# Altium schematic sheet reTerm-HW-M-IOLINK-STM32F4xx.SchDoc: reTerm IOLINK MCU
size 381 x 215 mm; DocumentNumber: 2; Revision: 1.0.0; SheetNumber: 3; SheetTotal: 4
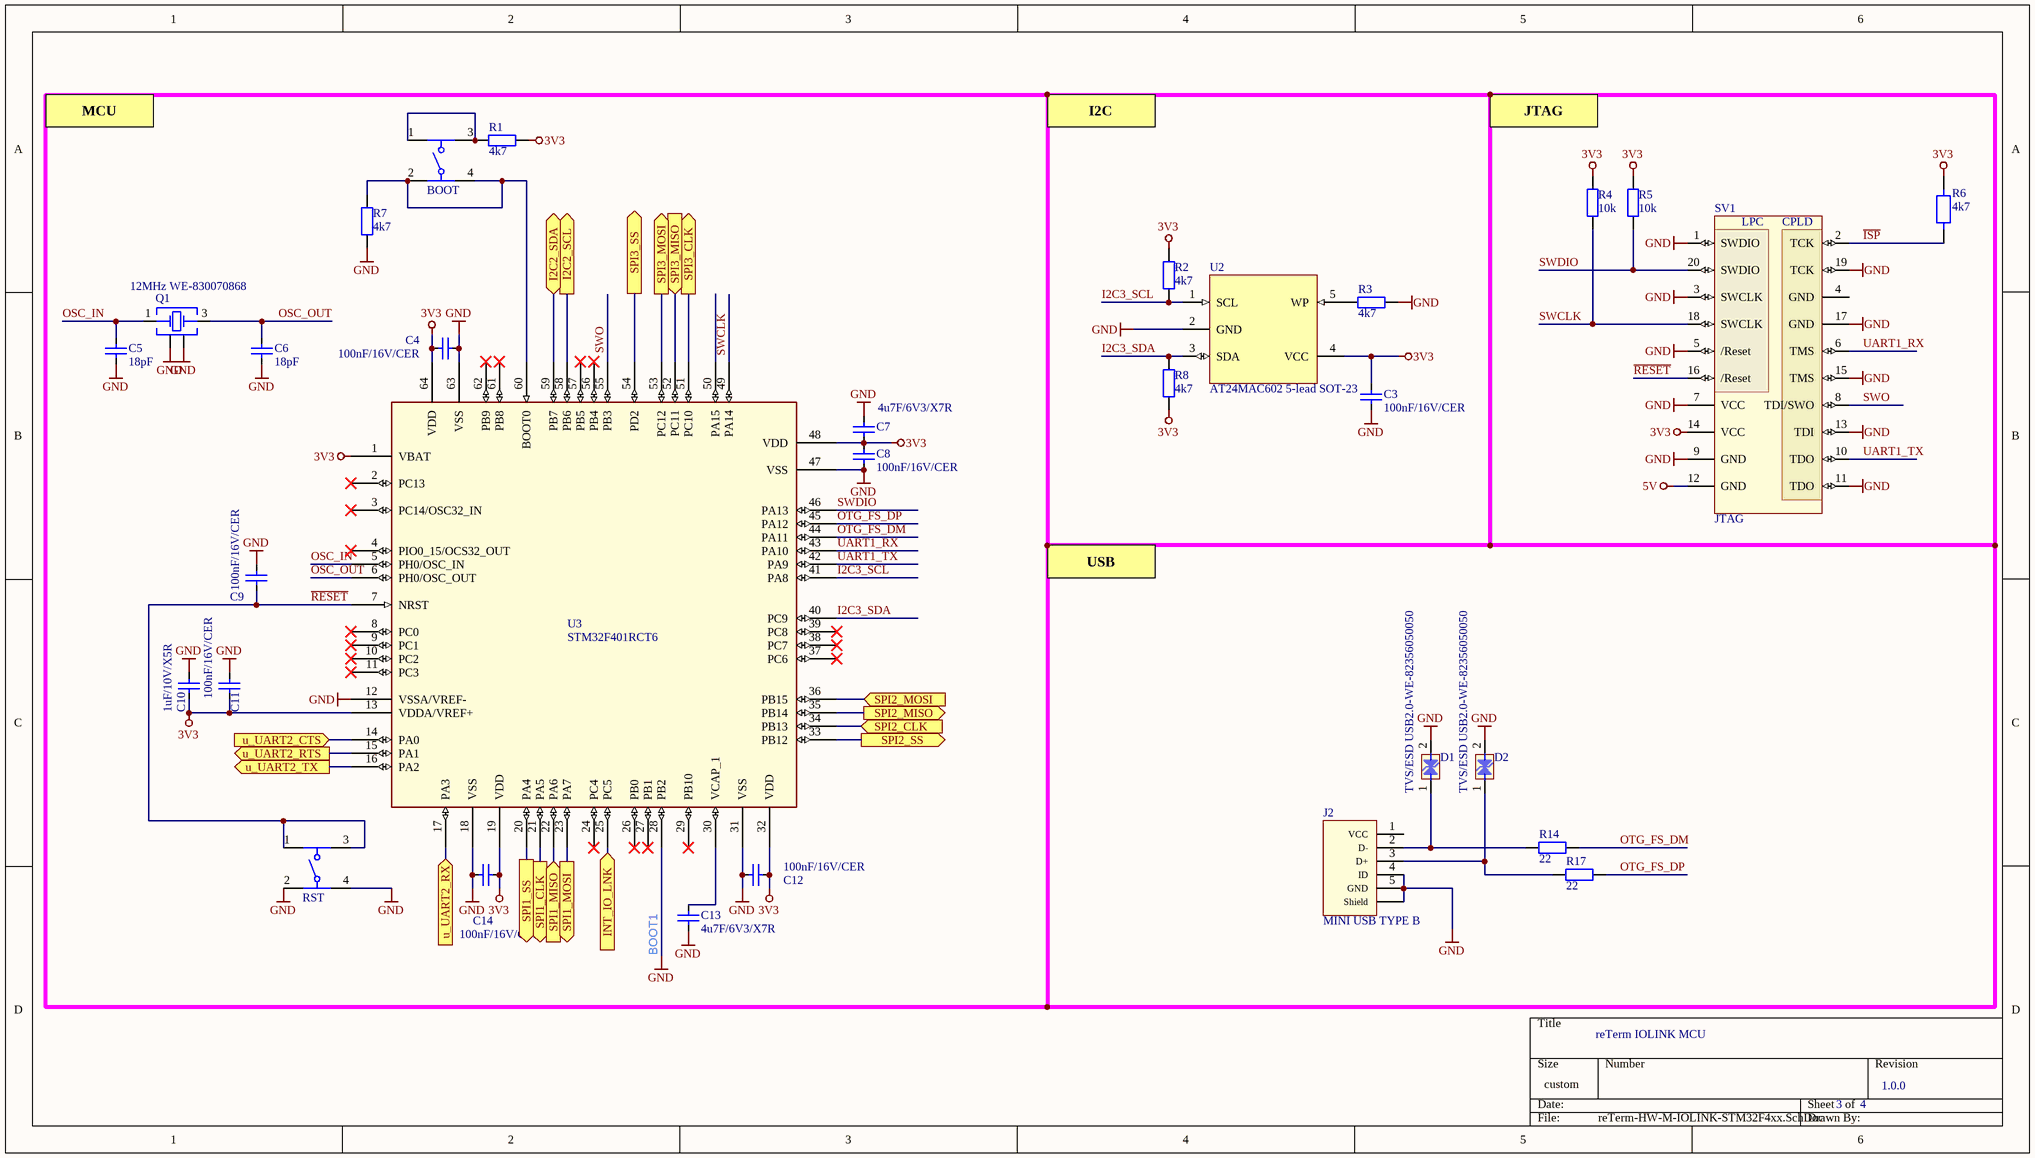
[diagram p0: reTerm-HW-M-IOLINK-STM32F4xx.SchDoc]

## Parts
BOOT  WS-TASV J-BEND, 434153017835  [434153017835]  (value not drawn)
C3  100nF/16V/CER  [C0603]
C4  100nF/16V/CER  [C0603]
C5  18pF  [C0603]
C6  18pF  [C0603]
C7  4u7F/6V3/X7R  [C0603]
C8  100nF/16V/CER  [C0603]
C9  100nF/16V/CER  [C0603]
C10  1uF/10V/X5R  [C0603]
C11  100nF/16V/CER  [C0603]
C12  100nF/16V/CER  [C0603]
C13  4u7F/6V3/X7R  [C0603]
C14  100nF/16V/CER  [C0603]
D1  TVS/ESD USB2.0-WE-82356050050  [TVS/ESD_WE-VE_0603]
D2  TVS/ESD USB2.0-WE-82356050050  [TVS/ESD_WE-VE_0603]
J2  MINI USB TYPE B  [MINI USB WR 65100516121]
Q1  12MHz WE-830070868  [WE-XTAL_CFPX-180]
R1  4k7  [R0603]
R2  4k7  [R0603]
R3  4k7  [R0603]
R4  10k  [R0603]
R5  10k  [R0603]
R6  4k7  [R0603]
R7  4k7  [R0603]
R8  4k7  [R0603]
R14  22  [R0603]
R17  22  [R0603]
RST  WS-TASV J-BEND, 434153017835  [434153017835]  (value not drawn)
SV1  JTAG  [JTAG-SAMTEC]  (no BOM)
U2  AT24MAC602 5-lead SOT-23  [SOT23-5]
U3  STM32F401RCT6  [LQFP64]

## Ports
I2C2_SCL (out), I2C2_SDA (bidir), INT_IO_LNK (in), SPI1_CLK (out), SPI1_MISO (in), SPI1_MOSI (out), SPI1_SS (out), SPI2_CLK (in), SPI2_MISO (out), SPI2_MOSI (in), SPI2_SS (out), SPI3_CLK (out), SPI3_MISO (in), SPI3_MOSI (out), SPI3_SS (out), u_UART2_CTS (in), u_UART2_RTS (out), u_UART2_RX (in), u_UART2_TX (out)

## Nets
3V3: C3.2 C4.1 C7.2 C8.2 C10.2 C11.1 C12.2 C14.2 R1.2 R2.2 R4.2 R5.2 R6.1 R8.1 SV1.14(VCC) U2.4(VCC) U3.1(VBAT) U3.13(VDDA/VREF+) U3.19(VDD) U3.32(VDD) U3.48(VDD) U3.64(VDD)
5V: SV1.12(GND)
GND: C3.1 C4.2 C5.1 C6.1 C7.1 C8.1 C9.2 C10.1 C11.2 C12.1 C13.1 C14.1 D1.2(I/O2) D2.2(I/O2) J2.4(ID) J2.5(GND) J2.Shell(Shield) Q1.2(GND) Q1.4(GND) R3.2 R7.1 RST.2 RST.4 SV1.1(SWDIO) SV1.3(SWCLK) SV1.5(/Reset) SV1.7(VCC) SV1.9(GND) SV1.11(TDO) SV1.13(TDI) SV1.15(TMS) SV1.17(GND) SV1.19(TCK) U2.2(GND) U3.12(VSSA/VREF-) U3.18(VSS) U3.28(PB2) U3.31(VSS) U3.47(VSS) U3.63(VSS)
I2C2_SCL: U3.58(PB6) ; port I2C2_SCL
I2C2_SDA: U3.59(PB7) ; port I2C2_SDA
I2C3_SCL: R2.1 U2.1(SCL) U3.41(PA8)
I2C3_SDA: R8.2 U2.3(SDA) U3.40(PC9)
~{ISP}: R6.2 SV1.2(TCK)
INT_IO_LNK: U3.25(PC5) ; port INT_IO_LNK
OSC_IN: C5.2 Q1.1(Crystal) U3.5(PH0/OSC_IN)
OSC_OUT: C6.2 Q1.3(Crystal) U3.6(PH0/OSC_OUT)
OTG_FS_DM: R14.2 U3.44(PA11)
OTG_FS_DP: R17.2 U3.45(PA12)
~{RESET}: C9.1 RST.1 RST.3 SV1.16(/Reset) U3.7(NRST)
SPI1_CLK: U3.21(PA5) ; port SPI1_CLK
SPI1_MISO: U3.22(PA6) ; port SPI1_MISO
SPI1_MOSI: U3.23(PA7) ; port SPI1_MOSI
SPI1_SS: U3.20(PA4) ; port SPI1_SS
SPI2_CLK: U3.34(PB13) ; port SPI2_CLK
SPI2_MISO: U3.35(PB14) ; port SPI2_MISO
SPI2_MOSI: U3.36(PB15) ; port SPI2_MOSI
SPI2_SS: U3.33(PB12) ; port SPI2_SS
SPI3_CLK: U3.51(PC10) ; port SPI3_CLK
SPI3_MISO: U3.52(PC11) ; port SPI3_MISO
SPI3_MOSI: U3.53(PC12) ; port SPI3_MOSI
SPI3_SS: U3.54(PD2) ; port SPI3_SS
SWCLK: R4.1 SV1.18(SWCLK) U3.49(PA14)
SWDIO: R5.1 SV1.20(SWDIO) U3.46(PA13)
SWO: SV1.8(TDI/SWO) U3.55(PB3)
u_UART2_CTS: U3.14(PA0) ; port u_UART2_CTS
u_UART2_RTS: U3.15(PA1) ; port u_UART2_RTS
u_UART2_RX: U3.17(PA3) ; port u_UART2_RX
u_UART2_TX: U3.16(PA2) ; port u_UART2_TX
UART1_RX: SV1.6(TMS) U3.43(PA10)
UART1_TX: SV1.10(TDO) U3.42(PA9)
NetBOOT_1: BOOT.1 BOOT.3 R1.1
NetBOOT_2: BOOT.2 BOOT.4 R7.2 U3.60(BOOT0)
NetC13_2: C13.2 U3.30(VCAP_1)
NetD1_1: D1.1(I/O1) J2.2(D-) R14.1
NetD2_1: D2.1(I/O1) J2.3(D+) R17.1
NetR3_1: R3.1 U2.5(WP)

Not connected (* = marked no-connect by the designer): J2 1(VCC); SV1 4(GND); U3 2(PC13)* 3(PC14/OSC32_IN)* 4(PIO0_15/OCS32_OUT)* 8(PC0)* 9(PC1)* 10(PC2)* 11(PC3)* 24(PC4)* 26(PB0)* 27(PB1)* 29(PB10)* 37(PC6)* 38(PC7)* 39(PC8)* 50(PA15) 56(PB4)* 57(PB5)* 61(PB8)* 62(PB9)*

## Notes on the sheet
- MCU
- I2C
- JTAG
- USB
- (near C13) BOOT1
- (in symbol JTAG-MSTKN) LPC; CPLD

## Library data of the parts
BOOT RST = WS-TASV J-BEND, 434153017835: 3.5x2.9mm SMD J-Bend WS-TASV, height 1.7 mm, 350 gf; Rated Current: 50 mA; Operation Force: 350 gf; Rated Voltage: 12 VDC; ComponentLink1Description: Manufacturer; ComponentLink1URL: http://www.we-online.de; ComponentLink2Description: Datasheet; ComponentLink2URL: http://katalog.we-online.de/em/datasheet/434153017835.pdf; Part Number: 434153017835; Published Date: Nov. 2017; Publisher: Wurth Elektronik; Life Cycle: 200000; Operating Temperature: -40 to +85 degC; Size: 3.5x2.9x1.7 mm
C3 C4 C8 C9 C11 C12 C14 = CAP_100nF_16V_CER: Supplier 1: Digi-Key; Supplier Part Number 1: 1276-1031-1-ND
C5 C6 = CAP_18pF
C7 C13 = CAP_4u7F/6V3/X7R: Supplier 1: Digi-Key; Supplier 2: Digi-Key; Supplier Part Number 1: 445-7482-1-ND; Supplier Part Number 2: 1276-1044-1-ND
C10 = CAP_1uF/10V/X5R: 1uF/10V/X5R 0603; Supplier 1: Mouser; Supplier 2: Digi-Key; Supplier Part Number 1: 80-C0603C105K8P; Supplier Part Number 2: 399-3118-1-ND
D1 D2 = TVS/ESD USB2.0-WE-82356050050: WE-VE ESD Suppressor, 0603, VDC=5V; Manufacturer: Wurth Elektronik; VDC: 5V; PartNo: 82356050050; ComponentLink1Description: Manufacturer; ComponentLink1URL: http://www.we-online.de; Created by: BJ.Chen; Created Date: Jan 2016; ComponentLink2Description: Datasheet; ComponentLink2URL: http://katalog.we-online.de/pbs/datasheet/82356050050.pdf
J2 = MINI USB TYPE B: Mini USB 2.0 Type B SMT Horizontal 5 Contacts WR-COM; Part Number: 65100516121; Interface Type: Type B; Gender: Receptacle; ComponentLink1Description: Manufacturer; ComponentLink1URL: http://www.we-online.de; ComponentLink2Description: Datasheet; ComponentLink2URL: http://katalog.we-online.de/em/datasheet/65100516121.pdf; Published Date: April 2017; Publisher: Wurth Elektronik; Sub-Family: Mini USB 2.0; Type: Horizontal; Construction: SMT
Q1 = QUARTZ 22 MHZ - WE-830070868: WE-XTAL Quartz Crystal, SMT, CFPX-180, 12MHz, +/-10ppm; Manufacturer: Wurth Elektronik; Frequency Stability: +/-20ppm; Load Capacitance: 18pF; ComponentLink1Description: Manufacturer; ComponentLink1URL: http://www.we-online.de; ComponentLink2Description: Datasheet; ComponentLink2URL: https://katalog.we-online.com/pbs/datasheet/830070868.pdf; Operating Temperature: -40 to +85degC; Packaging: Tape and Reel; Manufacturer Part Number: 830070868; Published Date: July 2020; Size: CFPX-180; Frequency: 12MHz; Frequency Tolerance: +/-10ppm; Mounting Technology: SMT; Supplier 1: Digi-Key; Supplier 2: Mouser; Supplier Part Number 1: 732-830070868CT-ND; Supplier Part Number 2: 710-830070868
R1-R3 R7 R8 = R4k7: Resistor-4k7
R4 R5 = R10k: Resistor-10k
R6 = RES2SS: Resistor; Text Field1: 30; Text Field2: 20
R14 R17 = R22: Resistor-22
SV1 = JTAG-MSTKN: JTAG - Samtec Edgeconnector
U2 = AT24MAC602: AT24MAC602 I2C-Compatible (2-wire) 2-Kbit Serial EEPROM with aFactory-Programmed EUI-48™ or EUI-64™Address; Supplier 1: Digi-Key; Supplier 2: Mouser; Supplier Part Number 2: 556-AT24MAC602-STUMT; Supplier Part Number 1: AT24MAC602-STUM-TCT-ND
U3 = STM32F401RCT6: ARM  ®   Cortex  ®  -M4 32b MCU+FPU 256MB Flash 64KB RAM; Supplier 1: Mouser; Supplier 2: Digi-Key; Supplier Part Number 1: 511-STM32F401RCT6; Supplier Part Number 2: 497-14047-ND